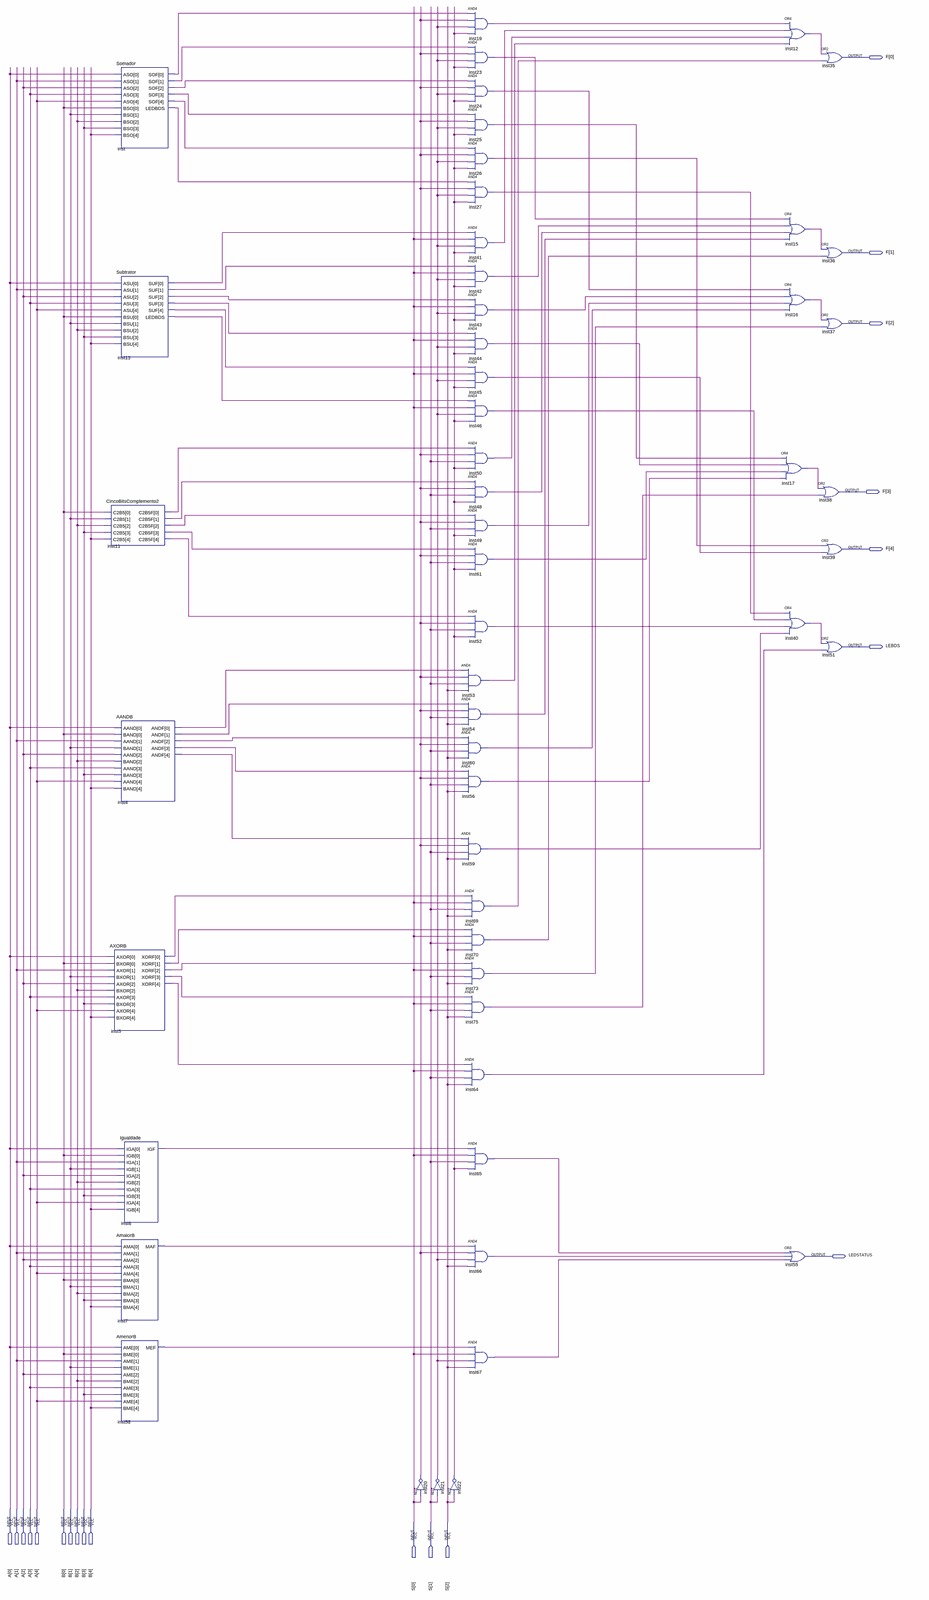
[diagram p0: schematic sheet, whole]
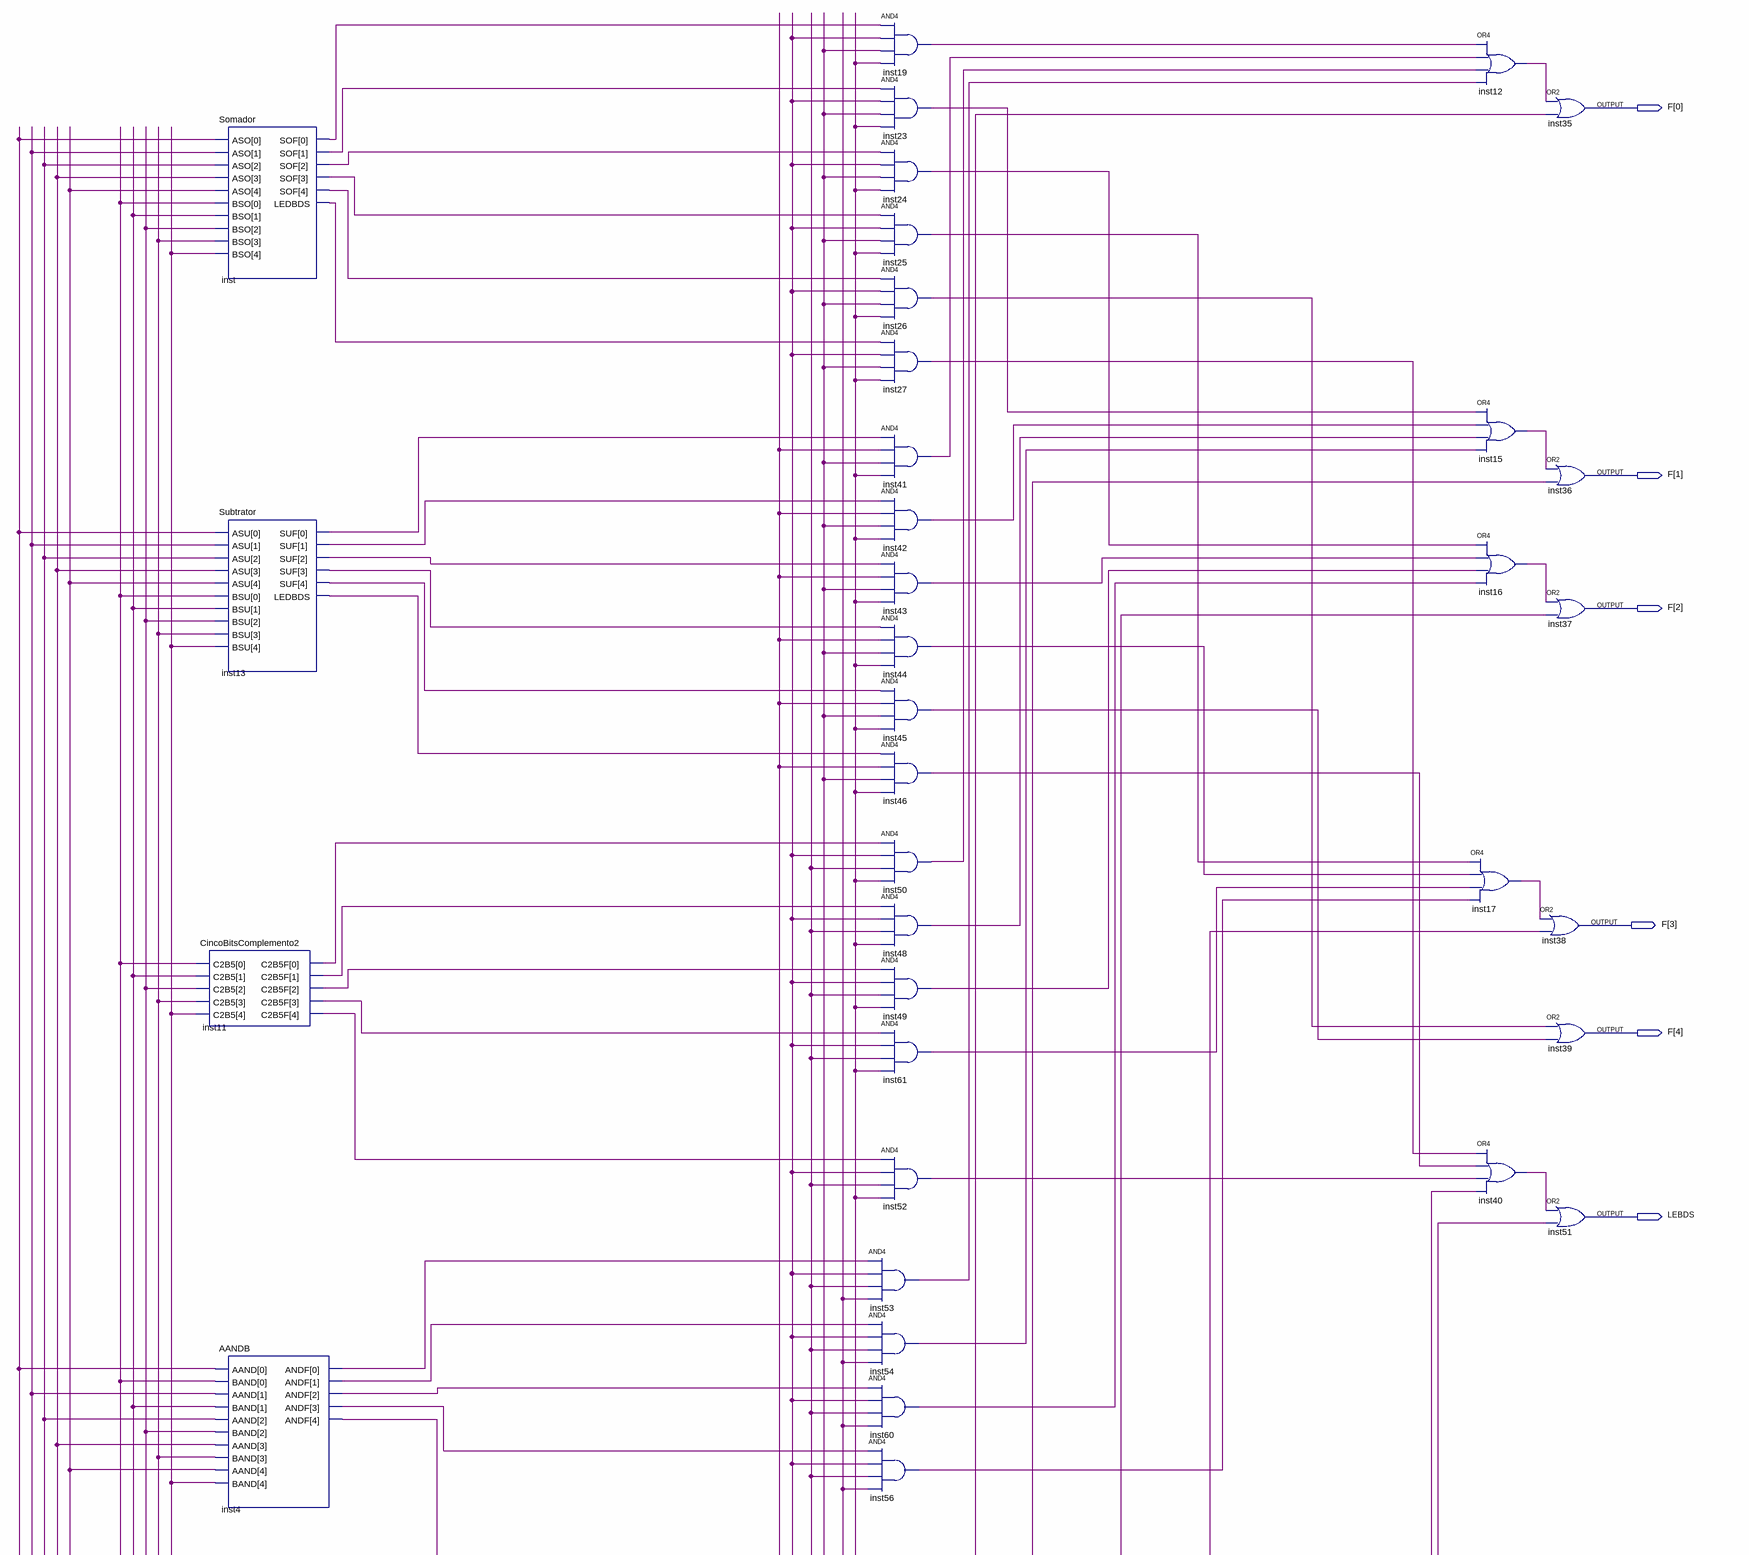
[diagram p1: schematic sheet, upper part]
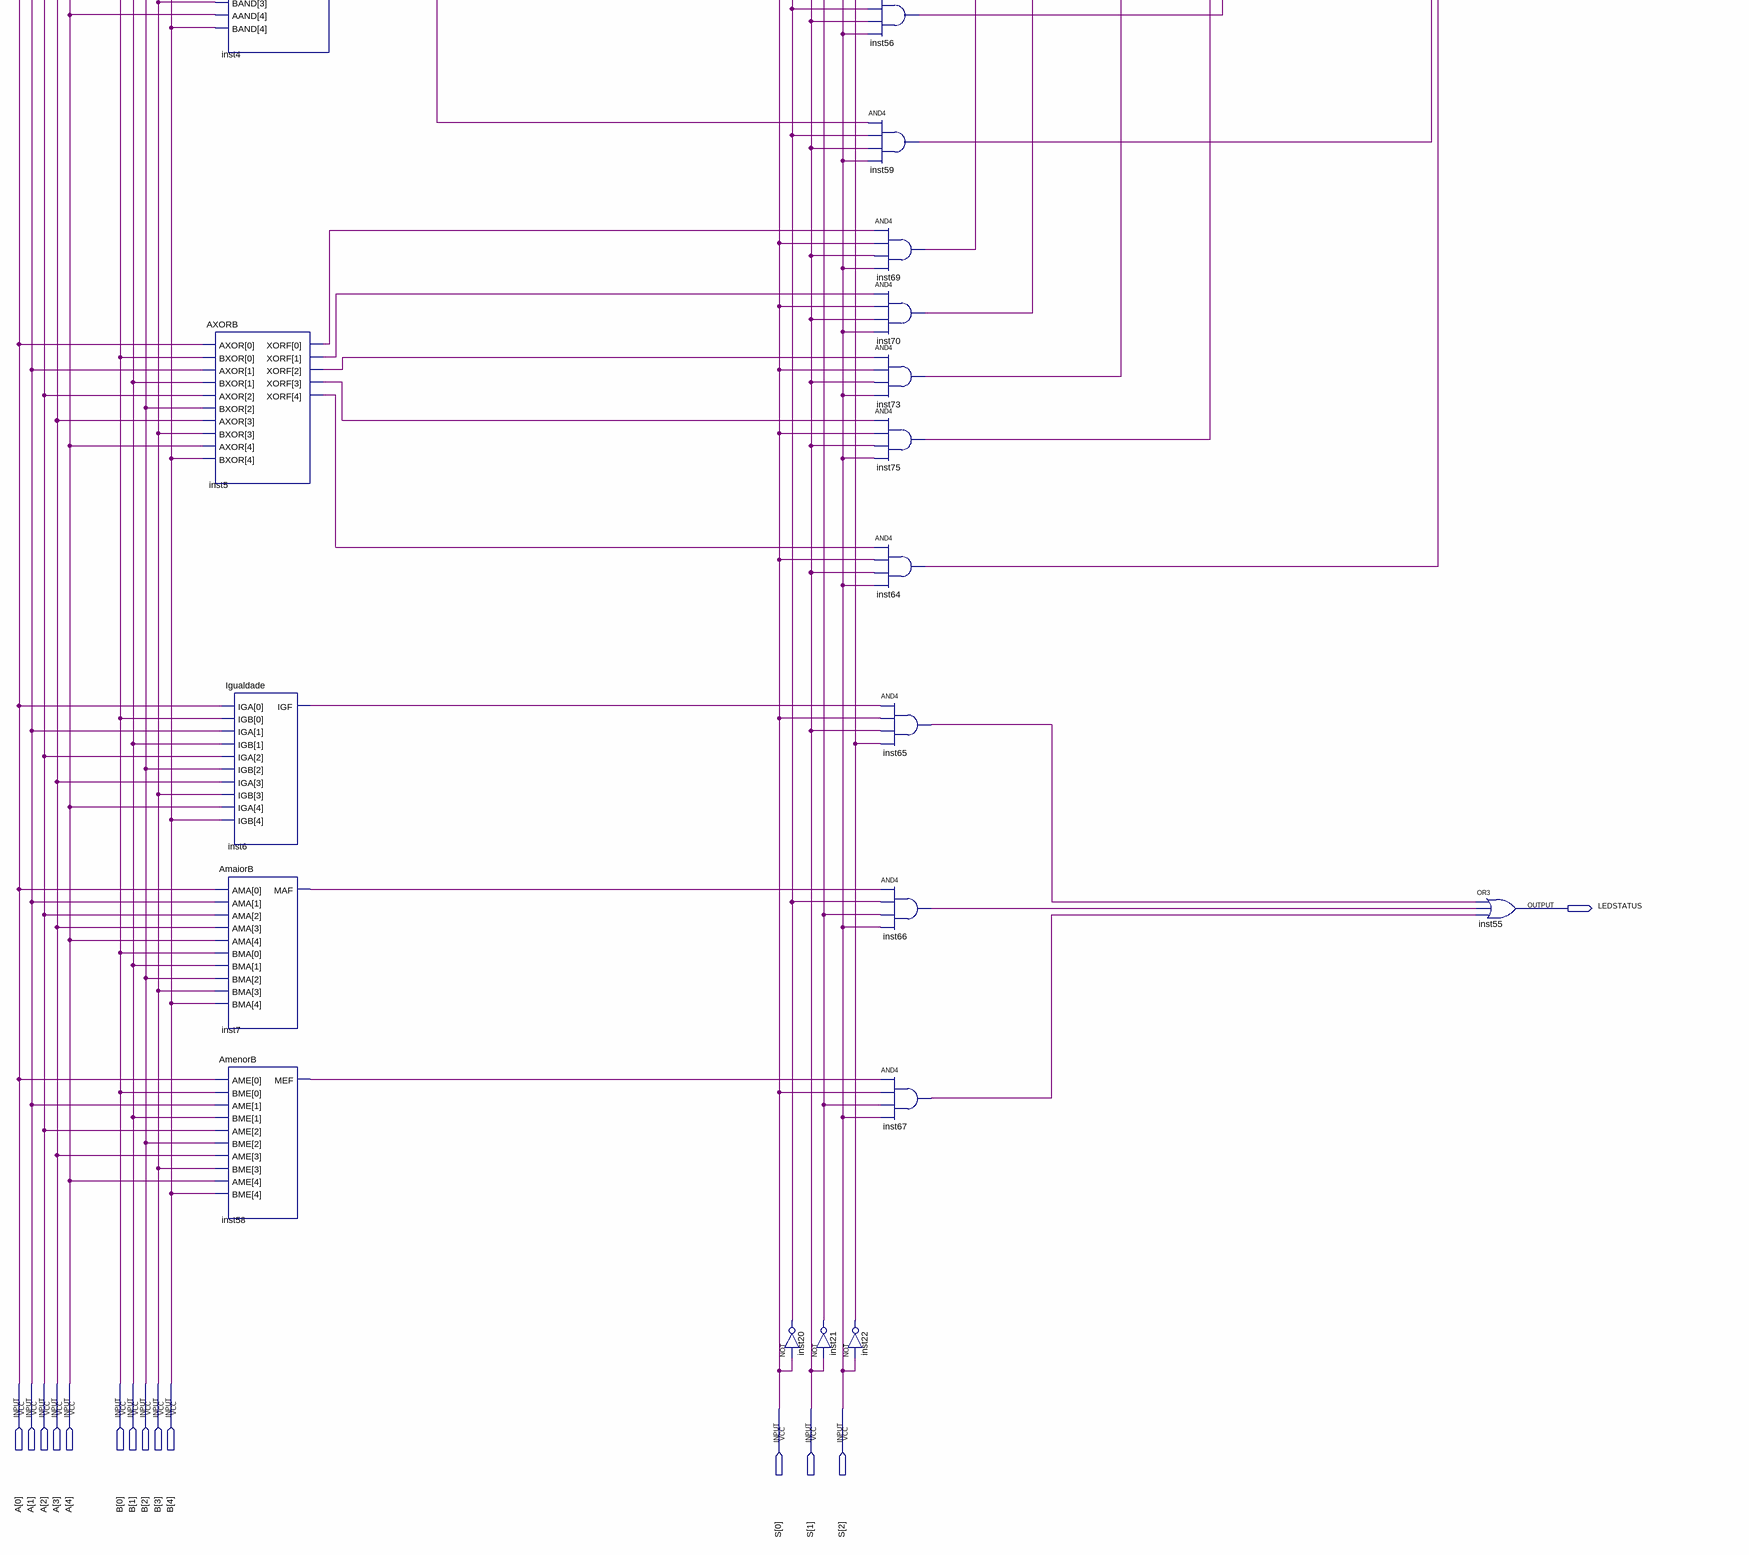
[diagram p2: schematic sheet, lower part]
// Quartus schematic ULAProjeto.bdf as structural Verilog: 53 symbols, 20 pins
module ULAProjeto (
  input  [4:0] A,
  input  [4:0] B,
  input  [2:0] S,
  output [4:0] F,
  output LEBDS,
  output LEDSTATUS
);

  wire inst4_andf, inst4_andf_2, inst4_andf_3, inst4_andf_4, inst4_andf_5, inst5_xorf, inst5_xorf_2,
       inst5_xorf_3, inst5_xorf_4, inst5_xorf_5, inst6_igf, inst7_maf, inst11_c2b5f, inst11_c2b5f_2,
       inst11_c2b5f_3, inst11_c2b5f_4, inst11_c2b5f_5, inst12_out, inst13_ledbds, inst13_suf, inst13_suf_2,
       inst13_suf_3, inst13_suf_4, inst13_suf_5, inst15_out, inst16_out, inst17_out, inst19_out, inst20_out,
       inst21_out, inst22_out, inst23_out, inst24_out, inst25_out, inst26_out, inst27_out, inst40_out,
       inst41_out, inst42_out, inst43_out, inst44_out, inst45_out, inst46_out, inst48_out, inst49_out,
       inst50_out, inst52_out, inst53_out, inst54_out, inst56_out, inst58_mef, inst59_out, inst60_out,
       inst61_out, inst64_out, inst65_out, inst66_out, inst67_out, inst69_out, inst70_out, inst73_out,
       inst75_out, inst_ledbds, inst_sof, inst_sof_2, inst_sof_3, inst_sof_4, inst_sof_5;

  CincoBitsComplemento2 inst11 (
    .C2B5(B), .C2B5F({inst11_c2b5f_4, inst11_c2b5f_3, inst11_c2b5f_2, inst11_c2b5f, inst11_c2b5f_5}));
  AXORB inst5 (.AXOR(A), .BXOR(B), .XORF({inst5_xorf, inst5_xorf_3, inst5_xorf_5, inst5_xorf_4, inst5_xorf_2}));
  Somador inst (
    .ASO(A), .BSO(B), .SOF({inst_sof_5, inst_sof_4, inst_sof_3, inst_sof_2, inst_sof}), .LEDBDS(inst_ledbds));
  Subtrator inst13 (
    .ASU(A), .BSU(B), .SUF({inst13_suf_4, inst13_suf_5, inst13_suf_3, inst13_suf_2, inst13_suf}),
    .LEDBDS(inst13_ledbds));
  AANDB inst4 (.AAND(A), .BAND(B), .ANDF({inst4_andf_5, inst4_andf_4, inst4_andf_3, inst4_andf_2, inst4_andf}));
  Igualdade inst6 (.IGA(A), .IGB(B), .IGF(inst6_igf));
  AmaiorB inst7 (.AMA(A), .BMA(B), .MAF(inst7_maf));
  AmenorB inst58 (.AME(A), .BME(B), .MEF(inst58_mef));
  not inst20 (inst20_out, S[0]);
  not inst21 (inst21_out, S[1]);
  not inst22 (inst22_out, S[2]);
  and inst19 (inst19_out, inst_sof, inst20_out, inst21_out, inst22_out);
  and inst23 (inst23_out, inst_sof_2, inst20_out, inst21_out, inst22_out);
  and inst24 (inst24_out, inst_sof_3, inst20_out, inst21_out, inst22_out);
  and inst25 (inst25_out, inst_sof_4, inst20_out, inst21_out, inst22_out);
  and inst26 (inst26_out, inst_sof_5, inst20_out, inst21_out, inst22_out);
  and inst27 (inst27_out, inst_ledbds, inst20_out, inst21_out, inst22_out);
  and inst41 (inst41_out, inst13_suf, S[0], inst21_out, inst22_out);
  and inst42 (inst42_out, inst13_suf_2, S[0], inst21_out, inst22_out);
  and inst43 (inst43_out, inst13_suf_3, S[0], inst21_out, inst22_out);
  and inst44 (inst44_out, inst13_suf_5, S[0], inst21_out, inst22_out);
  and inst45 (inst45_out, inst13_suf_4, S[0], inst21_out, inst22_out);
  and inst46 (inst46_out, inst13_ledbds, S[0], inst21_out, inst22_out);
  and inst50 (inst50_out, inst11_c2b5f_5, inst20_out, S[1], inst22_out);
  and inst48 (inst48_out, inst11_c2b5f, inst20_out, S[1], inst22_out);
  and inst49 (inst49_out, inst11_c2b5f_2, inst20_out, S[1], inst22_out);
  and inst61 (inst61_out, inst11_c2b5f_3, inst20_out, S[1], inst22_out);
  and inst52 (inst52_out, inst11_c2b5f_4, inst20_out, S[1], inst22_out);
  and inst53 (inst53_out, inst4_andf, inst20_out, S[1], S[2]);
  and inst54 (inst54_out, inst4_andf_2, inst20_out, S[1], S[2]);
  and inst60 (inst60_out, inst4_andf_3, inst20_out, S[1], S[2]);
  and inst56 (inst56_out, inst4_andf_4, inst20_out, S[1], S[2]);
  and inst59 (inst59_out, inst4_andf_5, inst20_out, S[1], S[2]);
  and inst69 (inst69_out, inst5_xorf_2, S[0], S[1], S[2]);
  and inst70 (inst70_out, inst5_xorf_4, S[0], S[1], S[2]);
  and inst73 (inst73_out, inst5_xorf_5, S[0], S[1], S[2]);
  and inst75 (inst75_out, inst5_xorf_3, S[0], S[1], S[2]);
  and inst64 (inst64_out, inst5_xorf, S[0], S[1], S[2]);
  and inst65 (inst65_out, inst6_igf, S[0], S[1], inst22_out);
  and inst66 (inst66_out, inst7_maf, inst20_out, inst21_out, S[2]);
  and inst67 (inst67_out, inst58_mef, S[0], inst21_out, S[2]);
  or inst17 (inst17_out, inst25_out, inst44_out, inst61_out, inst56_out);
  or inst12 (inst12_out, inst19_out, inst41_out, inst50_out, inst53_out);
  or inst15 (inst15_out, inst23_out, inst42_out, inst48_out, inst54_out);
  or inst16 (inst16_out, inst24_out, inst43_out, inst49_out, inst60_out);
  or inst40 (inst40_out, inst27_out, inst46_out, inst52_out, inst59_out);
  or inst55 (LEDSTATUS, inst65_out, inst66_out, inst67_out);
  or inst35 (F[0], inst12_out, inst69_out);
  or inst36 (F[1], inst15_out, inst70_out);
  or inst37 (F[2], inst16_out, inst73_out);
  or inst38 (F[3], inst17_out, inst75_out);
  or inst39 (F[4], inst26_out, inst45_out);
  or inst51 (LEBDS, inst40_out, inst64_out);
endmodule
